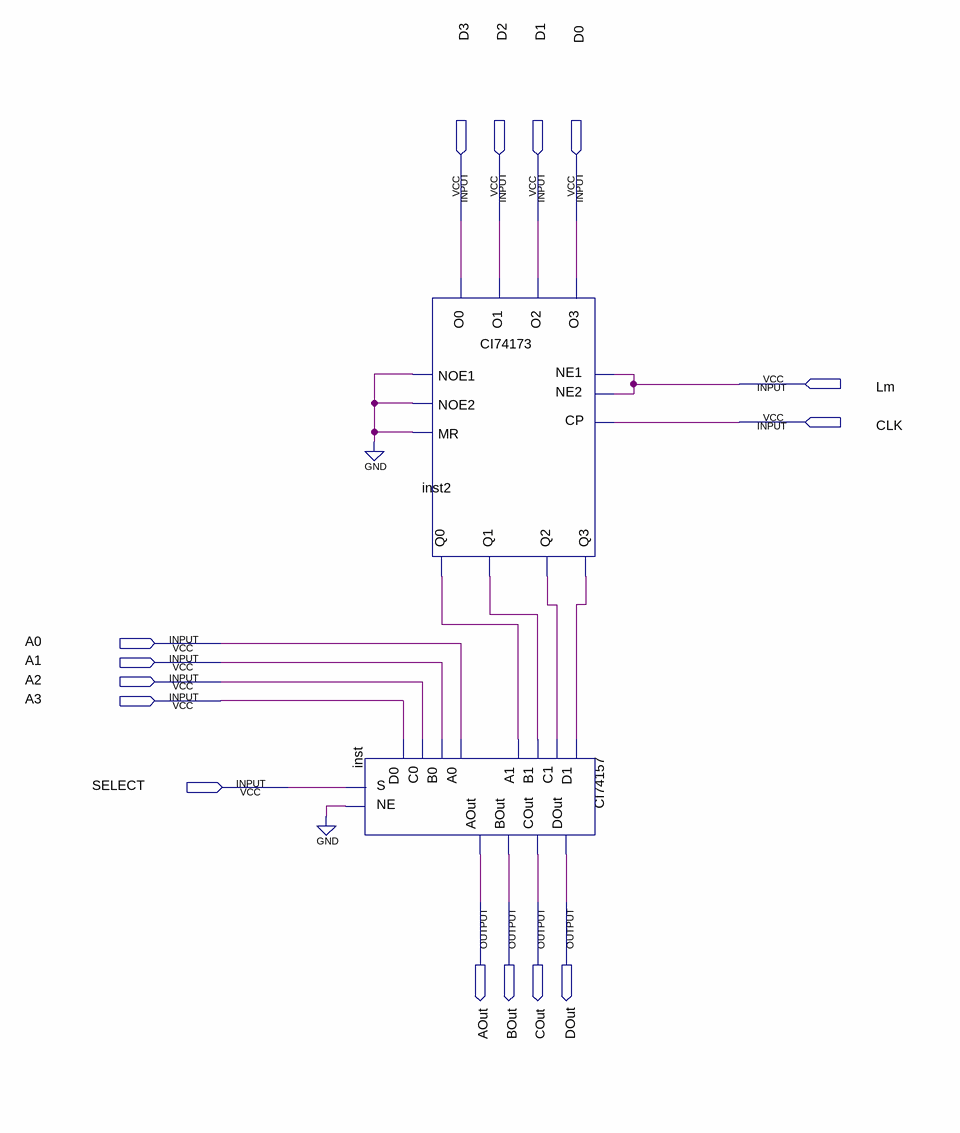
[diagram p0: schematic sheet]
// Quartus schematic MAR.bdf as structural Verilog: 2 symbols, 15 pins
module MAR (
  input  D3,
  input  D2,
  input  D1,
  input  D0,
  input  Lm,
  input  CLK,
  input  A0,
  input  A1,
  input  A2,
  input  A3,
  input  SELECT,
  output AOut,
  output BOut,
  output COut,
  output DOut
);

  wire inst2_q0, inst2_q1, inst2_q2, inst2_q3;

  CI74157 inst (
    .S(SELECT), .NE(1'b0), .A0(A0), .A1(inst2_q0), .B0(A1), .B1(inst2_q1), .C0(A2), .C1(inst2_q2),
    .D1(inst2_q3), .D0(A3), .DOut(DOut), .COut(COut), .BOut(BOut), .AOut(AOut));
  CI74173 inst2 (
    .O0(D3), .O1(D2), .O2(D1), .O3(D0), .NE1(Lm), .NE2(Lm), .CP(CLK), .MR(1'b0), .NOE1(1'b0), .NOE2(1'b0),
    .Q1(inst2_q1), .Q2(inst2_q2), .Q3(inst2_q3), .Q0(inst2_q0));
endmodule
